# Altium project 1CH_MtDrv_R01_V1-0924.PrjPcb
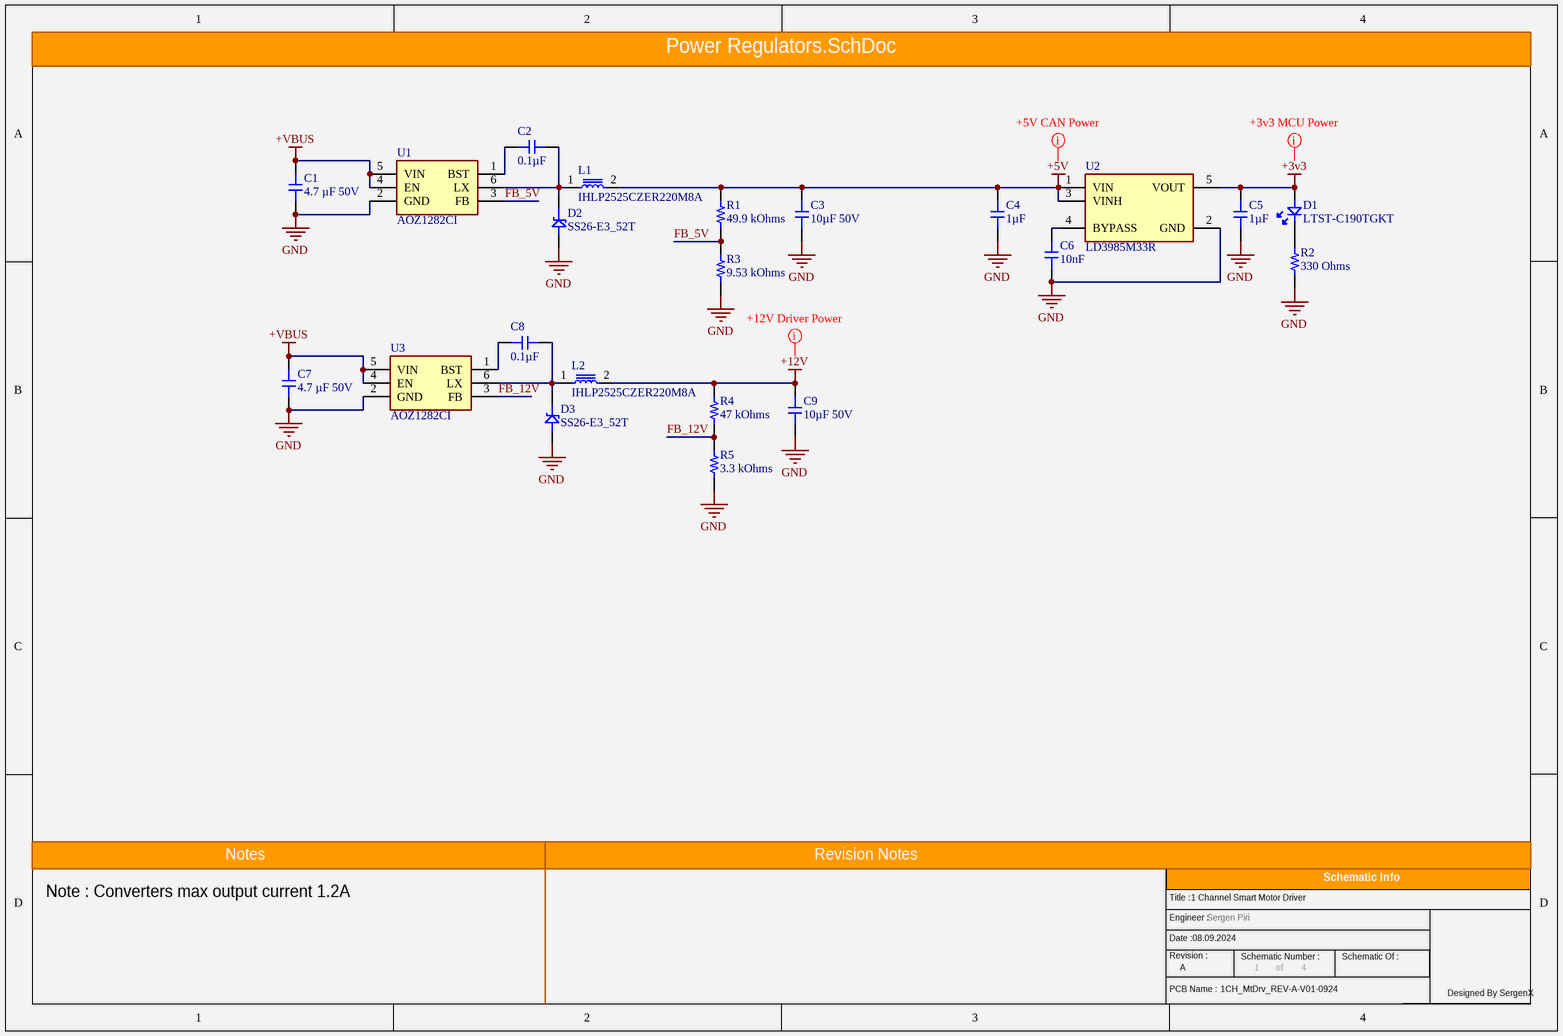
[diagram p0: Power Regulators.SchDoc]
Engineer: Sergen Piri; PCB_Name: 1CH_MtDrv_REV-A-V01-0924; SCH_Date: 08.09.2024; SCH_Rev: A; SCH_Title: 1 Channel Smart Motor Driver
4 sheets, 91 parts. Net scope: global (net labels, ports and power ports of the same name join across sheets).
Board file: 1CH_MtDrv_R01_V1-0924.PcbDoc
Sheets:
  Power Regulators.SchDoc
  MCU And Peripherals.SchDoc
  MCU Peripherals.SchDoc
  Motor Drivers.SchDoc

## Sheet Power Regulators.SchDoc
size A4; SheetNumber: 1; SheetTotal: 4

### Parts
C1  4.7 µF 50V  [1206_10uF]
C2  0.1µF  [0805]
C3  10µF 50V  [1206_10uF]
C4  1µF  [0603_Footprint]
C5  1µF  [0603_Footprint]
C6  10nF  [0603_Footprint]
C7  4.7 µF 50V  [1206_10uF]
C8  0.1µF  [0805]
C9  10µF 50V  [1206_10uF]
D1  LTST-C190TGKT  [LEDC1608X80N]
D2  SS26-E3_52T  [DIOM5436X244N]
D3  SS26-E3_52T  [DIOM5436X244N]
L1  IHLP2525CZER220M8A  [INDPM6965X300N]
L2  IHLP2525CZER220M8A  [INDPM6965X300N]
R1  49.9 kOhms  [0603_RES]
R2  330 Ohms  [0603_RES]
R3  9.53 kOhms  [0603_RES]
R4  47 kOhms  [0603_RES]
R5  3.3 kOhms  [0603_RES]
U1  AOZ1282CI  [SOT95P280X125-6N]
U2  LD3985M33R  [SOT95P280X145-5N]
U3  AOZ1282CI  [SOT95P280X125-6N]

### Nets
+3v3: C5.1 D1.2(A) U2.5(VOUT)
+5V: C3.1 C4.1 L1.2 R1.2 U2.1(VIN) U2.3(VINH)
+12V: C9.1 L2.2 R4.2
+VBUS: C1.1 C7.1 U1.4(EN) U1.5(VIN) U3.4(EN) U3.5(VIN)
GND: C1.2 C3.2 C4.2 C5.2 C6.2 C7.2 C9.2 D2.2(A) D3.2(A) R2.1 R3.1 R5.1 U1.2(GND) U2.2(GND) U3.2(GND)
FB_5V: R1.1 R3.2 U1.3(FB)
FB_12V: R4.1 R5.2 U3.3(FB)
NetC2_1: C2.1 U1.1(BST)
NetC2_2: C2.2 D2.1(K) L1.1 U1.6(LX)
NetC6_1: C6.1 U2.4(BYPASS)
NetC8_1: C8.1 U3.1(BST)
NetC8_2: C8.2 D3.1(K) L2.1 U3.6(LX)
NetD1_1: D1.1(K) R2.2

### Layout directives
mark named +12V Driver Power: (no net found under the mark)
mark named +5V CAN Power: (no net found under the mark)
mark named +3v3 MCU Power: (no net found under the mark)

### Notes on the sheet
- Note : Converters max output current 1.2A
- Notes
- Revision Notes
- Title :
- Engineer :
- Schematic Info
- Date :
- Revision :
- PCB Name :
- Schematic Number :
- of
- Schematic Of :
- Designed By SergenX

### Library data of the parts
C1 C7 = 4.7 uF 50V 1206: 10 uF 50V 1206
C2 C8 = 0.1uF 0805 Surface Capacitor
C3 C9 = 10 uF 50V 1206
C4 C5 = 1uF 0603 Surface Capacitor
C6 = 10nF 0603 Surface Capacitor
D1 = LTST-C190TGKT: 20mA Generic 0603 Led SMD; Manufacturer_Name: Lite-On; Manufacturer_Part_Number: LTST-C190KRKT; Datasheet Link: https://componentsearchengine.com/Datasheets/1/LTST-C190KRKT.pdf; Height: 0.8mm; Mouser Part Number: 859-LTST-C190KRKT; Mouser Price/Stock: https://www.mouser.co.uk/ProductDetail/Lite-On/LTST-C190KRKT?qs=kAD5fFa1n5VY3YYNWPC1Fg%3D%3D; Arrow Part Number: LTST-C190KRKT; Arrow Price/Stock: https://www.arrow.com/en/products/ltst-c190krkt/lite-on-technology?region=europe
D2 D3 = SS26-E3_52T: 2A SMD Schottky Diode; Manufacturer_Name: Vishay; Manufacturer_Part_Number: SS26-E3/52T; Datasheet Link: https://componentsearchengine.com/Datasheets/2/SS26-E3_52T.pdf; Height: 2.44mm; Mouser Part Number: 625-SS26-E3; Mouser Price/Stock: https://www.mouser.co.uk/ProductDetail/Vishay-General-Semiconductor/SS26-E3-52T?qs=x2jpVgRnAtNToatHaCRUvw%3D%3D; Arrow Part Number: SS26-E3/52T; Arrow Price/Stock: https://www.arrow.com/en/products/ss26-e352t/vishay?region=europe
L1 L2 = IHLP2525CZER220M8A: Fixed Inductor 22uH 2.8A 174 mOHM SMD; Manufacturer_Name: Vishay; Datasheet Link: https://componentsearchengine.com/Datasheets/2/IHLP2525CZER220M8A.pdf; Height: 3mm; Manufacturer_Part_Number: IHLP2525CZER220M8A; Mouser Part Number: 70-IHLP2525CZR220M8A; Mouser Price/Stock: https://www.mouser.co.uk/ProductDetail/Vishay-Dale/IHLP2525CZER220M8A?qs=ei%2FvZTf36ZyKyW60gc1ORQ%3D%3D; Arrow Part Number: IHLP2525CZER220M8A; Arrow Price/Stock: https://www.arrow.com/en/products/ihlp2525czer220m8a/vishay
R1 = 49.9 kOhms 0603
R2 = 330 Ohm 0603
R3 = 9.53 kOhms 0603
R4 = 47 kOhms 0603: 47 kOhm 0603
R5 = 3.3 kOhms 0603
U1 U3 = AOZ1282CI: +36V 1.2A Buck Converter; Manufacturer_Name: Alpha & Omega Semiconductors; Datasheet Link: http://www.aosmd.com/res/data_sheets/AOZ1282CI.pdf; Height: 1.25mm; Manufacturer_Part_Number: AOZ1282CI; Arrow Part Number: AOZ1282CI; Arrow Price/Stock: https://www.arrow.com/en/products/aoz1282ci/alpha-and-omega-semiconductor?region=nac
U2 = LD3985M33R: IC REG LIN 3.3V 150MA TSOT23-5; Package: None; Availability: Unavailable; Value: *; MP: LD3985M33R; Price: None

## Sheet MCU And Peripherals.SchDoc
size A4; SheetNumber: 2; SheetTotal: 4
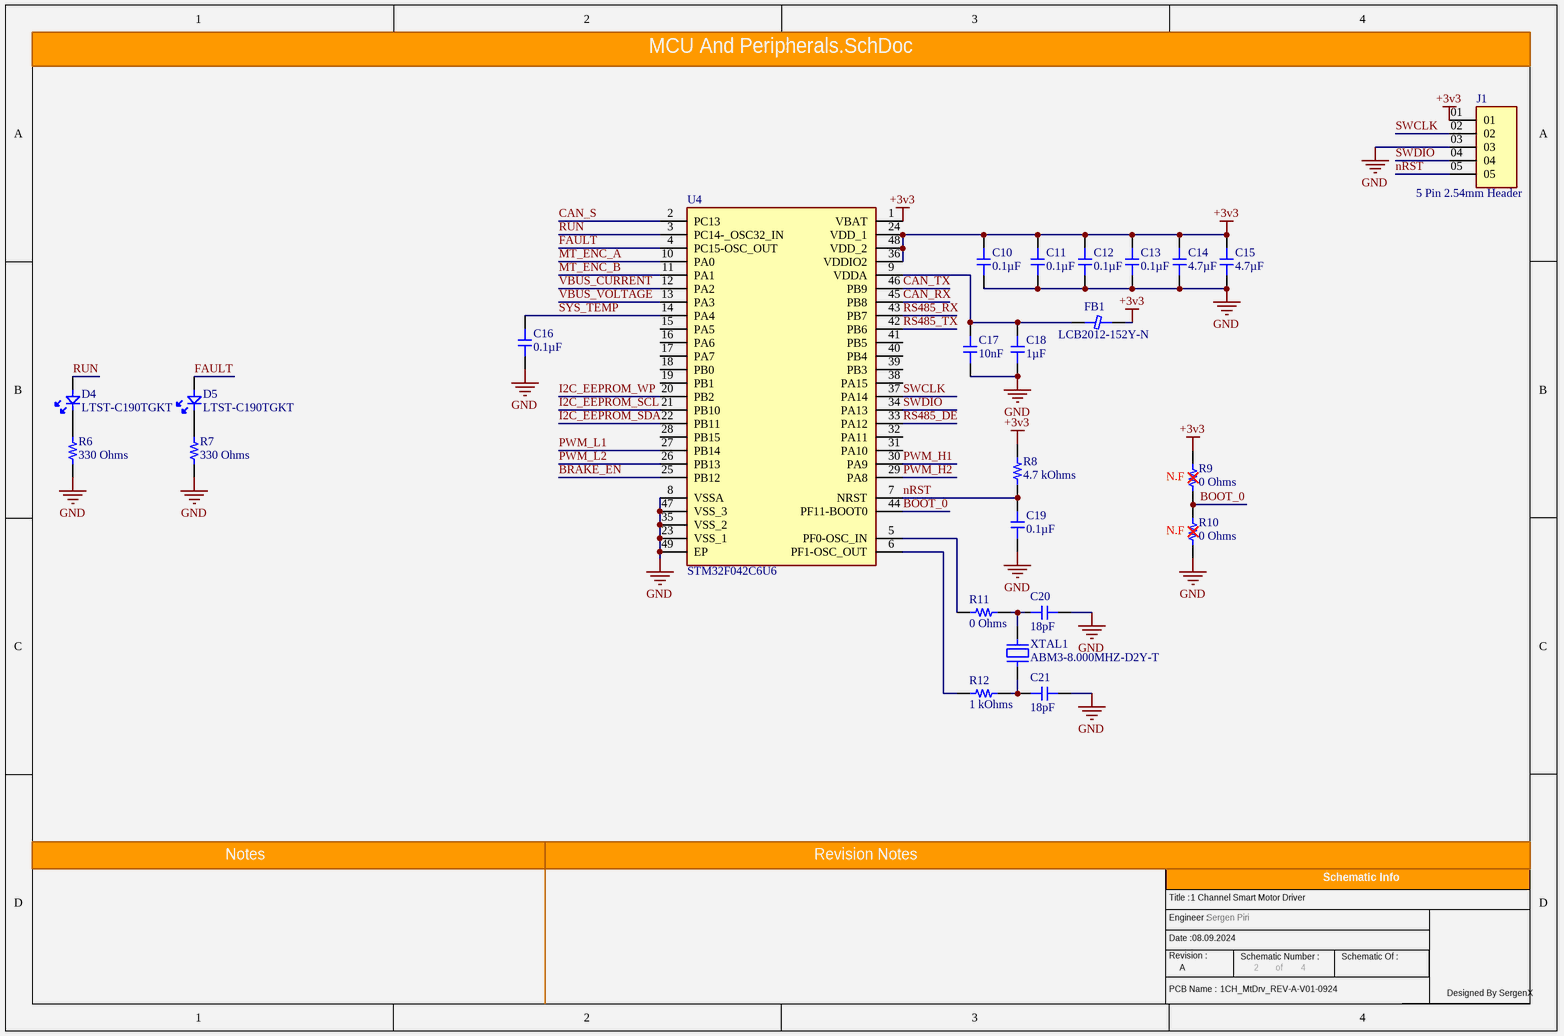
[diagram p1: MCU And Peripherals.SchDoc]

### Parts
C10  0.1µF  [0603_Footprint]
C11  0.1µF  [0603_Footprint]
C12  0.1µF  [0603_Footprint]
C13  0.1µF  [0603_Footprint]
C14  4.7µF  [0603_Footprint]
C15  4.7µF  [0603_Footprint]
C16  0.1µF  [0603_Footprint]
C17  10nF  [0603_Footprint]
C18  1µF  [0603_Footprint]
C19  0.1µF  [0603_Footprint]
C20  18pF  [0603_Footprint]
C21  18pF  [0603_Footprint]
D4  LTST-C190TGKT  [LEDC1608X80N]
D5  LTST-C190TGKT  [LEDC1608X80N]
FB1  LCB2012-152Y-N  [Inductor-0805]
J1  5 Pin 2.54mm Header  [5PIN_254MM]
R6  330 Ohms  [0603_RES]
R7  330 Ohms  [0603_RES]
R8  4.7 kOhms  [0603_RES]
R9  0 Ohms  [0603_RES]
R10  0 Ohms  [0603_RES]
R11  0 Ohms  [0603_RES]
R12  1 kOhms  [0603_RES]
U4  STM32F042C6U6  [QFN50P700X700X60-49N]
XTAL1  ABM3-8.000MHZ-D2Y-T  [ABM3]

### Nets
+3v3: C10.1 C11.1 C12.1 C13.1 C14.1 C15.1 FB1.2 J1.01 R8.2 R9.2 U4.1(VBAT) U4.24(VDD_1) U4.36(VDDIO2) U4.48(VDD_2)
GND: C10.2 C11.2 C12.2 C13.2 C14.2 C15.2 C16.2 C17.2 C18.2 C19.1 C20.2 C21.2 J1.03 R6.1 R7.1 R10.1 U4.8(VSSA) U4.23(VSS_1) U4.35(VSS_2) U4.47(VSS_3) U4.49(EP)
BOOT_0: R9.1 R10.2 U4.44(PF11-BOOT0)
BRAKE_EN: U4.25(PB12)
CAN_RX: U4.45(PB8)
CAN_S: U4.2(PC13)
CAN_TX: U4.46(PB9)
FAULT: D5.2(A) U4.4(PC15-OSC_OUT)
I2C_EEPROM_SCL: U4.21(PB10)
I2C_EEPROM_SDA: U4.22(PB11)
I2C_EEPROM_WP: U4.20(PB2)
MT_ENC_A: U4.10(PA0)
MT_ENC_B: U4.11(PA1)
nRST: C19.2 J1.05 R8.1 U4.7(NRST)
PWM_H1: U4.30(PA9)
PWM_H2: U4.29(PA8)
PWM_L1: U4.27(PB14)
PWM_L2: U4.26(PB13)
RS485_DE: U4.33(PA12)
RS485_RX: U4.43(PB7)
RS485_TX: U4.42(PB6)
RUN: D4.2(A) U4.3(PC14-_OSC32_IN)
SWCLK: J1.02 U4.37(PA14)
SWDIO: J1.04 U4.34(PA13)
SYS_TEMP: C16.1 U4.14(PA4)
VBUS_CURRENT: U4.12(PA2)
VBUS_VOLTAGE: U4.13(PA3)
NetC17_1: C17.1 C18.1 FB1.1 U4.9(VDDA)
NetC20_1: C20.1 R11.2 XTAL1.2
NetC21_1: C21.1 R12.2 XTAL1.1
NetD4_1: D4.1(K) R6.2
NetD5_1: D5.1(K) R7.2
NetR11_1: R11.1 U4.5(PF0-OSC_IN)
NetR12_1: R12.1 U4.6(PF1-OSC_OUT)

Not connected (* = marked no-connect by the designer): U4 15(PA5) 16(PA6) 17(PA7) 18(PB0) 19(PB1) 28(PB15) 31(PA10) 32(PA11) 38(PA15) 39(PB3) 40(PB4) 41(PB5)

### Notes on the sheet
- (near R9) N.F
- (near R10) N.F
- Notes
- Revision Notes
- Title :
- Engineer :
- Schematic Info
- Date :
- Revision :
- PCB Name :
- Schematic Number :
- of
- Schematic Of :
- Designed By SergenX

### Library data of the parts
C10-C13 C16 C19 = 0.1uF 0603 Surface Capacitor
C14 C15 = 4.7uF 0603 Surface Capacitor
C17 = 10nF 0603 Surface Capacitor
C18 = 1uF 0603 Surface Capacitor
C20 C21 = 18pF 0603 Surface Capacitor
D4 D5 = LTST-C190TGKT: as D1 on sheet Power Regulators; Datasheet Link: https://componentsearchengine.com/Datasheets/1/LTST-C190KRKT.pdf; Height: 0.8mm; Mouser Part Number: 859-LTST-C190KRKT; Mouser Price/Stock: https://www.mouser.co.uk/ProductDetail/Lite-On/LTST-C190KRKT?qs=kAD5fFa1n5VY3YYNWPC1Fg%3D%3D; Arrow Part Number: LTST-C190KRKT; Arrow Price/Stock: https://www.arrow.com/en/products/ltst-c190krkt/lite-on-technology?region=europe
FB1 = LCB2012-152Y-N: Ferrite Bead 1A 0805 SMD
J1 = 5 Pin 2.54mm Header: Generic 2.54MM 5 Pin Header; MP: MTSW-105-09-G-S-480; Availability: Unavailable; Package: None; Value: *; Price: None
R6 R7 = 330 Ohm 0603
R8 = 4.7 kOhms 0603
R9-R11 = 0 Ohm 0603
R12 = 1 kOhms 0603
U4 = STM32F042C6U6: STMICROELECTRONICS - STM32F042C6U6 - MCU, ARM CORTEX-M0, 48MHZ, UFQFPN-48; Geometry.Height: 0.65mm; Manufacturer_Name: STMicroelectronics; Manufacturer_Part_Number: STM32F042C6U6; Mouser Part Number: 511-STM32F042C6U6; Mouser Price/Stock: https://www.mouser.co.uk/ProductDetail/STMicroelectronics/STM32F042C6U6?qs=4l9S5vBWkUI%2FX%2FLe94sSqA%3D%3D; Arrow Part Number: STM32F042C6U6; Arrow Price/Stock: https://www.arrow.com/en/products/stm32f042c6u6/stmicroelectronics; Datasheet Link: https://www.st.com/resource/en/datasheet/stm32f042c6.pdf
XTAL1 = ABM3-8.000MHZ-D2Y-T: 8MHz 2 Pin SMD Crystal; Manufacturer_Name: ABRACON; Datasheet Link: https://abracon.com/Resonators/abm3.pdf; Height: 1.3mm; Manufacturer_Part_Number: ABM3-8.000MHZ-D2Y-T; Mouser Part Number: 815-ABM3-8-D2Y-T; Mouser Price/Stock: https://www.mouser.co.uk/ProductDetail/ABRACON/ABM3-8.000MHZ-D2Y-T?qs=ihRgKfnEsN4giUXjc3yS1g%3D%3D; Arrow Part Number: ABM3-8.000MHZ-D2Y-T; Arrow Price/Stock: https://www.arrow.com/en/products/abm3-8.000mhz-d2y-t/abracon?region=europe

## Sheet MCU Peripherals.SchDoc
size A4; SheetNumber: 3; SheetTotal: 4
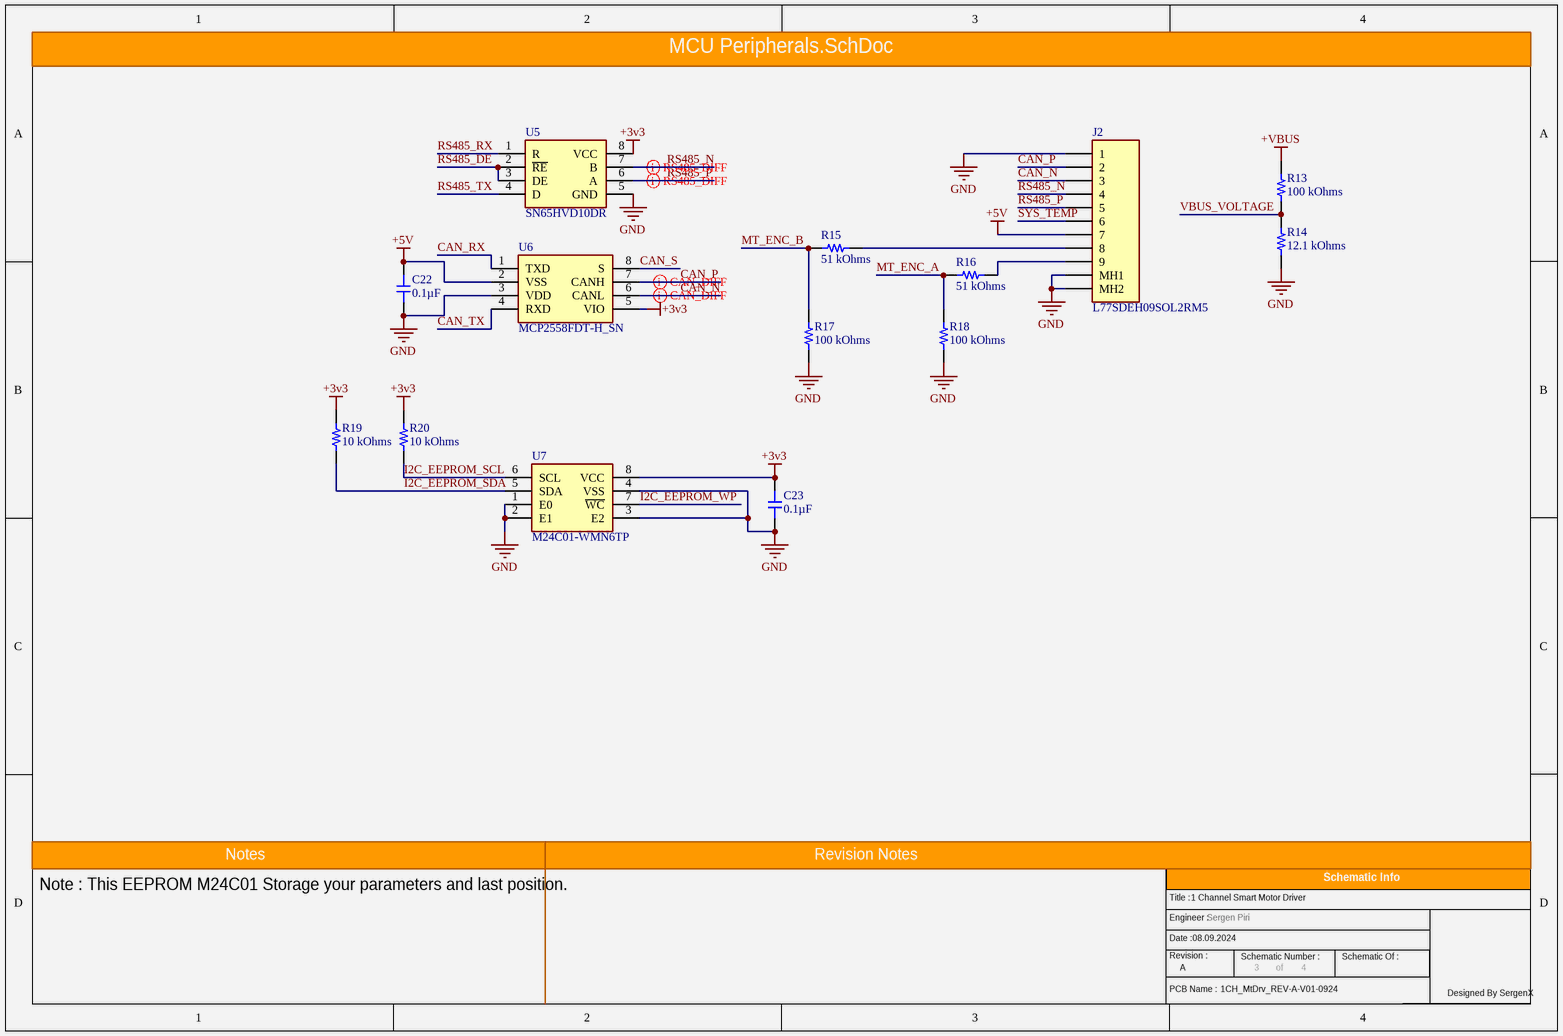
[diagram p2: MCU Peripherals.SchDoc]

### Parts
C22  0.1µF  [0603_Footprint]
C23  0.1µF  [0603_Footprint]
J2  L77SDEH09SOL2RM5  [L77SDEH09SOL2RM5]
R13  100 kOhms  [0603_RES]
R14  12.1 kOhms  [0603_RES]
R15  51 kOhms  [0603_RES]
R16  51 kOhms  [0603_RES]
R17  100 kOhms  [0603_RES]
R18  100 kOhms  [0603_RES]
R19  10 kOhms  [0603_RES]
R20  10 kOhms  [0603_RES]
U5  SN65HVD10DR  [SOIC127P600X175-8N]
U6  MCP2558FDT-H_SN  [SOIC127P600X175-8N]
U7  M24C01-WMN6TP  [SOIC127P600X175-8N]

### Nets
+3v3: C23.1 R19.2 R20.2 U5.8(VCC) U6.5(VIO) U7.8(VCC)
+5V: C22.1 J2.7 U6.2(VSS)
+VBUS: R13.2
GND: C22.2 C23.2 J2.1 J2.MH1 J2.MH2 R14.1 R17.1 R18.1 U5.5(GND) U6.3(VDD) U7.1(E0) U7.2(E1) U7.3(E2) U7.4(VSS)
CAN_N: J2.3 U6.6(CANL)
CAN_P: J2.2 U6.7(CANH)
CAN_RX: U6.1(TXD)
CAN_S: U6.8(S)
CAN_TX: U6.4(RXD)
I2C_EEPROM_SCL: R20.1 U7.6(SCL)
I2C_EEPROM_SDA: R19.1 U7.5(SDA)
I2C_EEPROM_WP: U7.7(~{WC})
MT_ENC_A: R16.2 R18.2
MT_ENC_B: R15.2 R17.2
RS485_DE: U5.2(~{RE}) U5.3(DE)
RS485_N: J2.4 U5.7(B)
RS485_P: J2.5 U5.6(A)
RS485_RX: U5.1(R)
RS485_TX: U5.4(D)
SYS_TEMP: J2.6
VBUS_VOLTAGE: R13.1 R14.2
NetJ2_8: J2.8 R15.1
NetJ2_9: J2.9 R16.1

### Layout directives
differential pair; differential pair class CAN_DIFF: CAN_N, CAN_P
differential pair; differential pair class RS485_DIFF: RS485_N, RS485_P

### Notes on the sheet
- Note : This EEPROM M24C01 Storage your parameters and last position.
- Notes
- Revision Notes
- Title :
- Engineer :
- Schematic Info
- Date :
- Revision :
- PCB Name :
- Schematic Number :
- of
- Schematic Of :
- Designed By SergenX

### Library data of the parts
C22 C23 = 0.1uF 0603 Surface Capacitor
J2 = L77SDEH09SOL2RM5: Dsub, Stamped Signal 3A, Straight PCB Thru Hole,  09 Socket, Flash Gold, Bright Tin Shell, 4-40 Threaded Standoff 6.0mm (0.236in), With Boardlock 4.2mm (0.165in); Manufacturer_Name: Amphenol Communications Solutions; Geometry.Height: 12.5mm; Manufacturer_Part_Number: L77SDEH09SOL2RM5; Mouser Part Number: 523-L77SDEH09SOL2RM5; Mouser Price/Stock: https://www.mouser.co.uk/ProductDetail/Amphenol-Commercial-Products/L77SDEH09SOL2RM5?qs=mq7kV%2Fq8lk5mrczxfq2%252BXg%3D%3D; Arrow Part Number: L77SDEH09SOL2RM5; Arrow Price/Stock: https://www.arrow.com/en/products/l77sdeh09sol2rm5/amphenol-fci?region=nac; Datasheet Link: https://cdn.amphenol-cs.com/media/wysiwyg/files/drawing/l77sdxhxxsol2rm5.pdf
R13 R17 R18 = 100k Ohm 0603
R14 = 12.1 kOhms 0603
R15 R16 = 51k Ohm 0603
R19 R20 = 10 kOhms 0603
U5 = SN65HVD10DR: 3.3V RS485 TRANSRECEIVER IC; Manufacturer_Name: Texas Instruments; Datasheet Link: http://www.ti.com/lit/gpn/sn65hvd10; Height: 1.75mm; Manufacturer_Part_Number: SN65HVD10DR; Mouser Part Number: 595-SN65HVD10DR; Mouser Price/Stock: https://www.mouser.co.uk/ProductDetail/Texas-Instruments/SN65HVD10DR?qs=QViXGNcIEAviyhAwS0yoXQ%3D%3D; Arrow Part Number: SN65HVD10DR; Arrow Price/Stock: https://www.arrow.com/en/products/sn65hvd10dr/texas-instruments?region=nac
U6 = MCP2558FDT-H_SN: CAN Interface IC CAN FD Transceiver with Silent Mode; Manufacturer_Name: Microchip; Manufacturer_Part_Number: MCP2558FDT-H/SN; Geometry.Height: 1.75mm; Mouser Part Number: 579-MCP2558FDT-H/SN; Mouser Price/Stock: https://www.mouser.co.uk/ProductDetail/Microchip-Technology/MCP2558FDT-H-SN?qs=ZEMkBHnybRFERYnvJEsEHA%3D%3D; Arrow Part Number: MCP2558FDT-H/SN; Arrow Price/Stock: https://www.arrow.com/en/products/mcp2558fdt-hsn/microchip-technology?region=nac; Datasheet Link: https://ww1.microchip.com/downloads/en/DeviceDoc/20005533A.pdf
U7 = M24C01-WMN6TP: EEPROM Memory IC 1Kb (128 x 8) IÂ²C 400kHz 900ns 8-SO; MF: STMicroelectronics; Mouser-Purchase-URL: https://snapeda.com/shop?store=Mouser&id=104564; DigiKey-Purchase-URL: https://snapeda.com/shop?store=DigiKey&id=104564; SnapEDA_Link: https://www.snapeda.com/parts/M24C01-WMN6TP/STMicroelectronics/view-part/104564/?ref=snap; Availability: Warning; MP: M24C01-WMN6TP; Price: None; Package: SO-8 STMicroelectronics; Value: *

## Sheet Motor Drivers.SchDoc
size A4; SheetNumber: 4; SheetTotal: 4
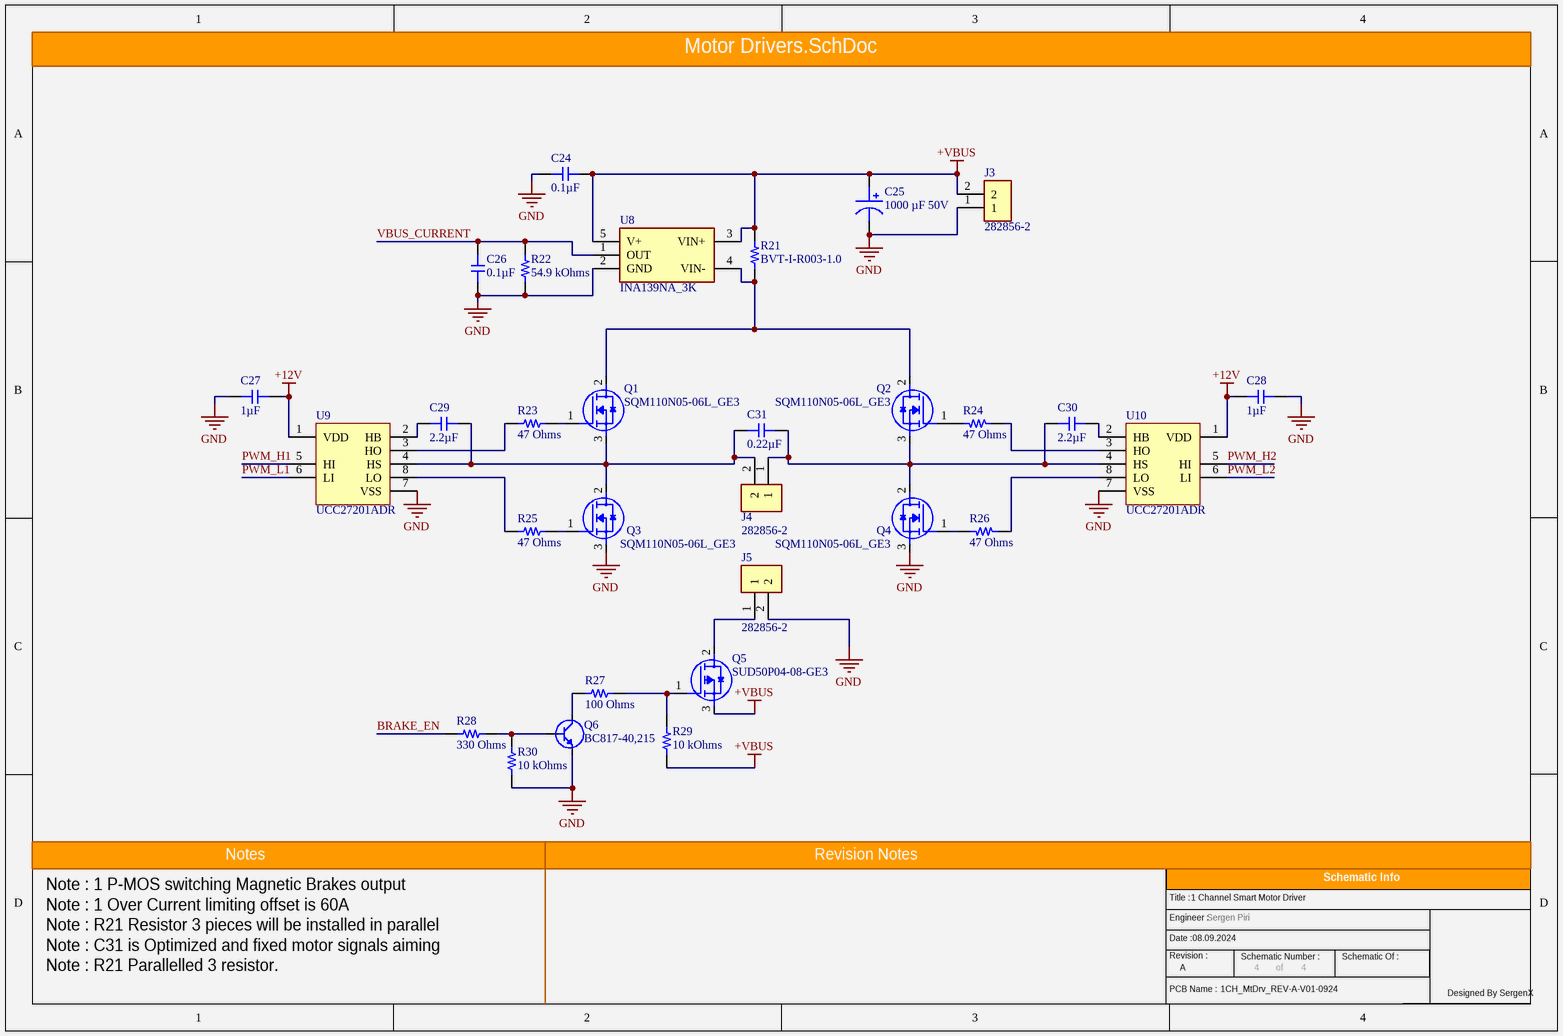
[diagram p3: Motor Drivers.SchDoc]

### Parts
C24  0.1µF  [0603_Footprint]
C25  1000 µF 50V  [CAPPRD500W60D1250H2500]
C26  0.1µF  [0603_Footprint]
C27  1µF  [0603_Footprint]
C28  1µF  [0603_Footprint]
C29  2.2µF  [0805]
C30  2.2µF  [0805]
C31  0.22µF  [0805]
J3  282856-2  [TE_282856-2]
J4  282856-2  [TE_282856-2]
J5  282856-2  [TE_282856-2]
Q1  SQM110N05-06L_GE3  [DPAK254P1524X457-3N]
Q2  SQM110N05-06L_GE3  [DPAK254P1524X457-3N]
Q3  SQM110N05-06L_GE3  [DPAK254P1524X457-3N]
Q4  SQM110N05-06L_GE3  [DPAK254P1524X457-3N]
Q5  SUD50P04-08-GE3  [TO-252]
Q6  BC817-40,215  [BC81740215]
R21  BVT-I-R003-1.0  [BVTIR00310]
R22  54.9 kOhms  [0603_RES]
R23  47 Ohms  [0603_RES]
R24  47 Ohms  [0603_RES]
R25  47 Ohms  [0603_RES]
R26  47 Ohms  [0603_RES]
R27  100 Ohms  [0603_RES]
R28  330 Ohms  [0603_RES]
R29  10 kOhms  [0603_RES]
R30  10 kOhms  [0603_RES]
U8  INA139NA_3K  [SOT95P280X145-5N]
U9  UCC27201ADR  [SOIC127P599X175-8N]
U10  UCC27201ADR  [SOIC127P599X175-8N]

### Nets
+12V: C27.2 C28.2 U9.1(VDD) U10.1(VDD)
+VBUS: C24.1 C25.P J3.2 Q5.3(S) R21.2 R29.1 U8.3(VIN+) U8.5(V+)
GND: C24.2 C25.N C26.1 C27.1 C28.1 J3.1 J5.2 Q3.3(S) Q4.3(S) Q6.2(E) R22.1 R30.2 U8.2(GND) U9.7(VSS) U10.7(VSS)
BRAKE_EN: R28.1
PWM_H1: U9.5(HI)
PWM_H2: U10.5(HI)
PWM_L1: U9.6(LI)
PWM_L2: U10.6(LI)
VBUS_CURRENT: C26.2 R22.2 U8.1(OUT)
NetC29_1: C29.1 U9.2(HB)
NetC29_2: C29.2 C31.1 J4.2 Q1.3(S) Q3.2(D) U9.4(HS)
NetC30_1: C30.1 U10.2(HB)
NetC30_2: C30.2 C31.2 J4.1 Q2.3(S) Q4.2(D) U10.4(HS)
NetJ5_1: J5.1 Q5.2(D)
NetQ1_1: Q1.1(G) R23.2
NetQ1_2: Q1.2(D) Q2.2(D) R21.1 U8.4(VIN-)
NetQ2_1: Q2.1(G) R24.2
NetQ3_1: Q3.1(G) R25.2
NetQ4_1: Q4.1(G) R26.2
NetQ5_1: Q5.1(G) R27.2 R29.2
NetQ6_1: Q6.1(B) R28.2 R30.1
NetQ6_3: Q6.3(C) R27.1
NetR23_1: R23.1 U9.3(HO)
NetR24_1: R24.1 U10.3(HO)
NetR25_1: R25.1 U9.8(LO)
NetR26_1: R26.1 U10.8(LO)

### Notes on the sheet
- Note : 1 P-MOS switching Magnetic Brakes output
- Note : 1 Over Current limiting offset is 60A
- Note : R21 Resistor 3 pieces will be installed in parallel
- Note : C31 is Optimized and fixed motor signals aiming
- Note : R21 Parallelled 3 resistor.
- Notes
- Revision Notes
- Title :
- Engineer :
- Schematic Info
- Date :
- Revision :
- PCB Name :
- Schematic Number :
- of
- Schematic Of :
- Designed By SergenX

### Library data of the parts
C24 C26 = 0.1uF 0603 Surface Capacitor
C25 = ECA1HM102: 1000µF 50V Aluminum Electrolytic Capacitors Radial, Can 2000 Hrs @ 85Â°C
C27 C28 = 1uF 0603 Surface Capacitor
C29 C30 = 2.2uF 0805 Surface Capacitor
C31 = 0.22uF 0805 Surface Capacitor
J3-J5 = 282856-2: TERMI-BLOK PCB MOUNT 2P; MF: TE Connectivity; Purchase-URL: https://pricing.snapeda.com/search/part/282856-2/?ref=eda; Package: None; MP: 282856-2; EU_RoHS_Compliance: Compliant with Exemptions; Price: None; Availability: In Stock; Value: *; Check_prices: https://www.snapeda.com/parts/282856-2/TE+Connectivity+AMP+Connectors/view-part/?ref=eda; SnapEDA_Link: https://www.snapeda.com/parts/282856-2/TE+Connectivity+AMP+Connectors/view-part/?ref=snap
Q1-Q4 = SQM110N05-06L_GE3: MOSFET DIS.110A 55V N-CH; MP: IPB60R165CP; MF: Infineon; Availability: In Stock; Package: TO-263 Infineon; SnapEDA_Link: https://www.snapeda.com/parts/IPB60R165CP/Infineon/view-part/?ref=snap; Price: None; Value: *; Check_prices: https://www.snapeda.com/parts/IPB60R165CP/Infineon/view-part/?ref=eda
Q5 = SUD50P04-08-GE3: MOSFET (P-Channel) 50V 40A 8mOhms; Manufacturer_Name: Vishay; Datasheet Link: https://www.vishay.com/docs/65594/sud50p04-08.pdf; Height: 2.38mm; Manufacturer_Part_Number: SUD50P04-08-GE3; Mouser Part Number: 781-SUD50P04-08-GE3; Mouser Price/Stock: https://www.mouser.co.uk/ProductDetail/Vishay-Semiconductors/SUD50P04-08-GE3?qs=WX95TUc1y56BTDQkv3VCeQ%3D%3D; Arrow Part Number: SUD50P04-08-GE3; Arrow Price/Stock: https://www.arrow.com/en/products/sud50p04-08-ge3/vishay?region=europe
Q6 = BC817-40,215: 0.5A 45V BJT NPN Transistor SOT23 SMD; Manufacturer_Name: Nexperia; Datasheet Link: https://assets.nexperia.com/documents/data-sheet/BC817_SER.pdf; Height: 1.1mm; Manufacturer_Part_Number: BC817-40,215; Mouser Part Number: 771-BC817-40-T/R; Mouser Price/Stock: https://www.mouser.co.uk/ProductDetail/Nexperia/BC817-40215?qs=me8TqzrmIYU%252B245p8hOLaQ%3D%3D; Arrow Part Number: BC817-40,215; Arrow Price/Stock: https://www.arrow.com/en/products/bc817-40215/nexperia?region=nac
R21 = BVT-I-R003-1.0: 3mOhm Resistor 2510 SMD Package; Manufacturer_Name: Isabellenhutte; Datasheet Link: https://www.isabellenhuetteusa.com/wp-content/uploads/2020/05/BVT.pdf; Height: 0.38mm; Manufacturer_Part_Number: BVT-I-R003-1.0
R22 = 54.9k Ohm 0603
R23-R26 = 47 Ohm 0603
R27 = 100 Ohm 0603
R28 = 330 Ohm 0603
R29 R30 = 10 kOhms 0603
U8 = INA139NA_3K: %0.5 Current Monitor 60V Analog SMD; Manufacturer_Name: Texas Instruments; Manufacturer_Part_Number: INA139NA/3K; Datasheet Link: http://www.ti.com/lit/gpn/ina139; Height: 1.45mm; Mouser Part Number: 595-INA139NA/3K; Mouser Price/Stock: https://www.mouser.co.uk/ProductDetail/Texas-Instruments/INA139NA-3K?qs=VBduBm9rCJS5yg1Xiaw5Dw%3D%3D; Arrow Part Number: INA139NA/3K; Arrow Price/Stock: https://www.arrow.com/en/products/ina139na3k/texas-instruments?region=nac
U9 U10 = UCC27201ADR: 3-A, 120-V half bridge gate driver with 8-V UVLO and negative voltage handling; MF: Texas Instruments; MP: UCC27201ADR; Price: None; SnapEDA_Link: https://www.snapeda.com/parts/UCC27201ADR/Texas+Instruments/view-part/?ref=snap; Purchase-URL: https://pricing.snapeda.com/search/part/UCC27201ADR/?ref=eda; Availability: In Stock; Check_prices: https://www.snapeda.com/parts/UCC27201ADR/Texas+Instruments/view-part/?ref=eda; Value: *; Package: SOIC-8 Texas Instruments

## Nets that join several sheets
+3v3: Power Regulators (C5.1 D1.2 U2.5), MCU And Peripherals (14 pins), MCU Peripherals (6 pins)
+5V: Power Regulators (6 pins), MCU Peripherals (C22.1 J2.7 U6.2)
+12V: Power Regulators (C9.1 L2.2 R4.2), Motor Drivers (C27.2 C28.2 U9.1 U10.1)
+VBUS: Power Regulators (6 pins), MCU Peripherals (R13.2), Motor Drivers (8 pins)
GND: Power Regulators (15 pins), MCU And Peripherals (21 pins), MCU Peripherals (14 pins), Motor Drivers (15 pins)
BRAKE_EN: MCU And Peripherals (U4.25), Motor Drivers (R28.1)
CAN_RX: MCU And Peripherals (U4.45), MCU Peripherals (U6.1)
CAN_S: MCU And Peripherals (U4.2), MCU Peripherals (U6.8)
CAN_TX: MCU And Peripherals (U4.46), MCU Peripherals (U6.4)
I2C_EEPROM_SCL: MCU And Peripherals (U4.21), MCU Peripherals (R20.1 U7.6)
I2C_EEPROM_SDA: MCU And Peripherals (U4.22), MCU Peripherals (R19.1 U7.5)
I2C_EEPROM_WP: MCU And Peripherals (U4.20), MCU Peripherals (U7.7)
MT_ENC_A: MCU And Peripherals (U4.10), MCU Peripherals (R16.2 R18.2)
MT_ENC_B: MCU And Peripherals (U4.11), MCU Peripherals (R15.2 R17.2)
PWM_H1: MCU And Peripherals (U4.30), Motor Drivers (U9.5)
PWM_H2: MCU And Peripherals (U4.29), Motor Drivers (U10.5)
PWM_L1: MCU And Peripherals (U4.27), Motor Drivers (U9.6)
PWM_L2: MCU And Peripherals (U4.26), Motor Drivers (U10.6)
RS485_DE: MCU And Peripherals (U4.33), MCU Peripherals (U5.2 U5.3)
RS485_RX: MCU And Peripherals (U4.43), MCU Peripherals (U5.1)
RS485_TX: MCU And Peripherals (U4.42), MCU Peripherals (U5.4)
SYS_TEMP: MCU And Peripherals (C16.1 U4.14), MCU Peripherals (J2.6)
VBUS_CURRENT: MCU And Peripherals (U4.12), Motor Drivers (C26.2 R22.2 U8.1)
VBUS_VOLTAGE: MCU And Peripherals (U4.13), MCU Peripherals (R13.1 R14.2)